# Altium schematic sheet STM32F407.SchDoc
size A3; Organization: ORGANIZATION; Address1: ADDRESS 1; Address2: ADDRESS 2; Address3: ADDRESS 3; Address4: ADDRESS 4; Revision: -; SheetNumber: 10; SheetTotal: 11; ENG_APP_DATE: --/--/--; DSN_APP_DATE: --/--/--; CHK_APP_DATE: --/--/--
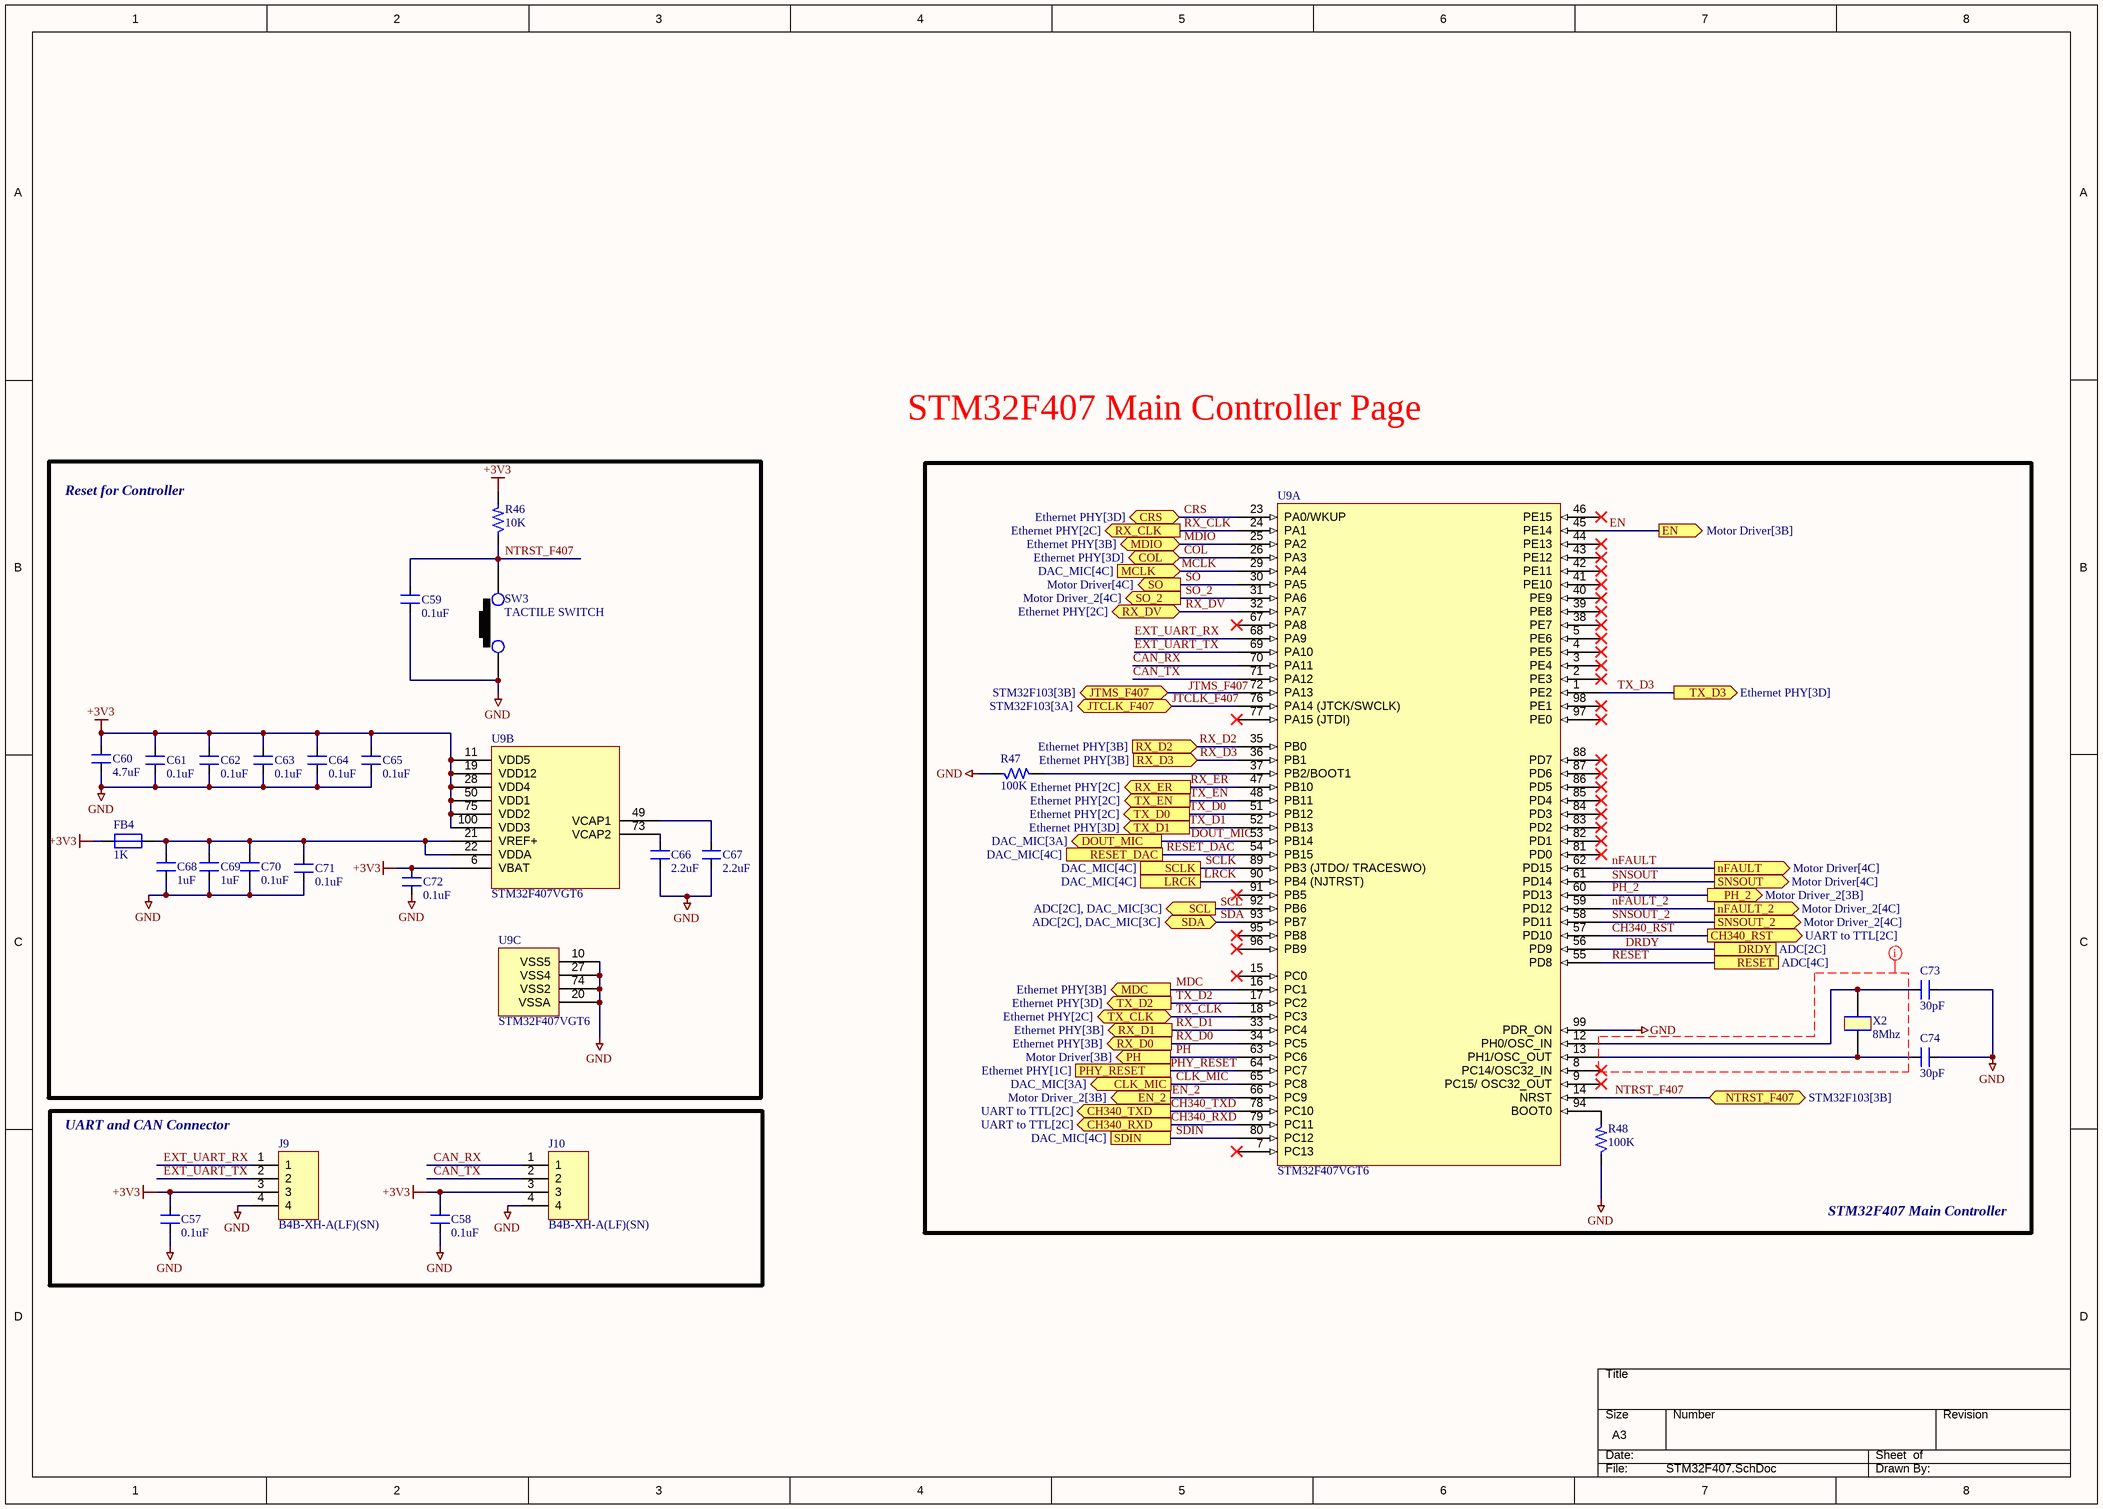
[diagram p0: STM32F407.SchDoc]

## Parts
C57  0.1uF  [CAP_0805]
C58  0.1uF  [CAP_0805]
C59  0.1uF  [CAP_0805]
C60  4.7uF  [CAP_0805]
C61  0.1uF  [CAP_0805]
C62  0.1uF  [CAP_0805]
C63  0.1uF  [CAP_0805]
C64  0.1uF  [CAP_0805]
C65  0.1uF  [CAP_0805]
C66  2.2uF  [CAP_0805]
C67  2.2uF  [CAP_0805]
C68  1uF  [CAP_0805]
C69  1uF  [CAP_0805]
C70  0.1uF  [CAP_0805]
C71  0.1uF  [CAP_0805]
C72  0.1uF  [CAP_0805]
C73  30pF  [CAP_0805]
C74  30pF  [CAP_0805]
FB4  1K  [IND_0805]
J9  B4B-XH-A(LF)(SN)  [CON4_100_B4B-XH-A_TH_ST]
J10  B4B-XH-A(LF)(SN)  [CON4_100_B4B-XH-A_TH_ST]
R46  10K  [RES_0603]
R47  100K  [RES_0603]
R48  100K  [RES_0603]
SW3  TACTILE SWITCH  [SW_342_SMD]
U9  STM32F407VGT6  [QFN100_19.6_669_58X10_SMD]  (parts A,B,C of 3)
X2  8Mhz  [XTAL_314_240X47_SMD]

## Blocks framed on the sheet
Reset for Controller: C59-C72 FB4 R46 SW3 U9
STM32F407 Main Controller: C73 C74 R47 R48 U9 X2
UART and CAN Connector: C57 C58 J9 J10

## Ports
CH340_RST (out, see UART to TTL[2C]), CH340_RXD (out, see UART to TTL[2C]), CH340_TXD (out, see UART to TTL[2C]), CLK_MIC (out, see DAC_MIC[3A]), COL (bidir, see Ethernet PHY[3D]), CRS (bidir, see Ethernet PHY[3D]), DOUT_MIC (out, see DAC_MIC[3A]), DRDY (see ADC[2C]), EN (out, see Motor Driver[3B]), EN_2 (out, see Motor Driver_2[3B]), JTCLK_F407 (bidir, see STM32F103[3A]), JTMS_F407 (bidir, see STM32F103[3B]), LRCK (see DAC_MIC[4C]), MCLK (in, see DAC_MIC[4C]), MDC (out, see Ethernet PHY[3B]), MDIO (bidir, see Ethernet PHY[3B]), nFAULT (out, see Motor Driver[4C]), nFAULT_2 (out, see Motor Driver_2[4C]), NTRST_F407 (bidir, see STM32F103[3B]), PH (out, see Motor Driver[3B]), PH_2 (out, see Motor Driver_2[3B]), PHY_RESET (see Ethernet PHY[1C]), RESET (see ADC[4C]), RESET_DAC (see DAC_MIC[4C]), RX_CLK (out, see Ethernet PHY[2C]), RX_D0 (out, see Ethernet PHY[3B]), RX_D1 (out, see Ethernet PHY[3B]), RX_D2 (in, see Ethernet PHY[3B]), RX_D3 (in, see Ethernet PHY[3B]), RX_DV (bidir, see Ethernet PHY[2C]), RX_ER (out, see Ethernet PHY[2C]), SCL (out, see ADC[2C], DAC_MIC[3C]), SCLK (see DAC_MIC[4C]), SDA (bidir, see ADC[2C], DAC_MIC[3C]), SDIN (see DAC_MIC[4C]), SNSOUT (out, see Motor Driver[4C]), SNSOUT_2 (out, see Motor Driver_2[4C]), SO (out, see Motor Driver[4C]), SO_2 (out, see Motor Driver_2[4C]), TX_CLK (bidir, see Ethernet PHY[2C]), TX_D0 (out, see Ethernet PHY[2C]), TX_D1 (out, see Ethernet PHY[3D]), TX_D2 (out, see Ethernet PHY[3D]), TX_D3 (out, see Ethernet PHY[3D]), TX_EN (out, see Ethernet PHY[2C])

## Nets
+3V3: C57.2 C58.2 C60.2 C61.2 C62.2 C63.2 C64.2 C65.2 C72.2 FB4.1 J9.3 J10.3 R46.2 U9.6(VBAT) U9.11(VDD5) U9.19(VDD12) U9.28(VDD4) U9.50(VDD1) U9.75(VDD2) U9.100(VDD3)
GND: C57.1 C58.1 C59.1 C60.1 C61.1 C62.1 C63.1 C64.1 C65.1 C66.1 C67.1 C68.1 C69.1 C70.1 C71.1 C72.1 C73.2 C74.2 J9.4 J10.4 R47.1 R48.1 SW3.1 U9.10(VSS5) U9.20(VSSA) U9.27(VSS4) U9.74(VSS2) U9.99(PDR_ON)
CAN_RX: J10.1 U9.70(PA11)
CAN_TX: J10.2 U9.71(PA12)
CH340_RST: U9.57(PD10) ; port CH340_RST
CH340_RXD: U9.79(PC11) ; port CH340_RXD
CH340_TXD: U9.78(PC10) ; port CH340_TXD
CLK_MIC: U9.65(PC8) ; port CLK_MIC
COL: U9.26(PA3) ; port COL
CRS: U9.23(PA0/WKUP) ; port CRS
DOUT_MIC: U9.53(PB14) ; port DOUT_MIC
DRDY: U9.56(PD9) ; port DRDY
EN: U9.45(PE14) ; port EN
EN_2: U9.66(PC9) ; port EN_2
EXT_UART_RX: J9.1 U9.68(PA9)
EXT_UART_TX: J9.2 U9.69(PA10)
JTCLK_F407: U9.76(PA14_(JTCK/SWCLK)) ; port JTCLK_F407
JTMS_F407: U9.72(PA13) ; port JTMS_F407
LRCK: U9.90(PB4_(NJTRST)) ; port LRCK
MCLK: U9.29(PA4) ; port MCLK
MDC: U9.16(PC1) ; port MDC
MDIO: U9.25(PA2) ; port MDIO
nFAULT: U9.62(PD15) ; port nFAULT
nFAULT_2: U9.59(PD12) ; port nFAULT_2
NTRST_F407: C59.2 R46.1 SW3.2 U9.14(NRST) ; port NTRST_F407
PH: U9.63(PC6) ; port PH
PH_2: U9.60(PD13) ; port PH_2
PHY_RESET: U9.64(PC7) ; port PHY_RESET
RESET: U9.55(PD8) ; port RESET
RESET_DAC: U9.54(PB15) ; port RESET_DAC
RX_CLK: U9.24(PA1) ; port RX_CLK
RX_D0: U9.34(PC5) ; port RX_D0
RX_D1: U9.33(PC4) ; port RX_D1
RX_D2: U9.35(PB0) ; port RX_D2
RX_D3: U9.36(PB1) ; port RX_D3
RX_DV: U9.32(PA7) ; port RX_DV
RX_ER: U9.47(PB10) ; port RX_ER
SCL: U9.92(PB6) ; port SCL
SCLK: U9.89(PB3_(JTDO/_TRACESWO)) ; port SCLK
SDA: U9.93(PB7) ; port SDA
SDIN: U9.80(PC12) ; port SDIN
SNSOUT: U9.61(PD14) ; port SNSOUT
SNSOUT_2: U9.58(PD11) ; port SNSOUT_2
SO: U9.30(PA5) ; port SO
SO_2: U9.31(PA6) ; port SO_2
TX_CLK: U9.18(PC3) ; port TX_CLK
TX_D0: U9.51(PB12) ; port TX_D0
TX_D1: U9.52(PB13) ; port TX_D1
TX_D2: U9.17(PC2) ; port TX_D2
TX_D3: U9.1(PE2) ; port TX_D3
TX_EN: U9.48(PB11) ; port TX_EN
NetC66_2: C66.2 U9.73(VCAP2)
NetC67_2: C67.2 U9.49(VCAP1)
NetC68_2: C68.2 C69.2 C70.2 C71.2 FB4.2 U9.21(VREF+) U9.22(VDDA)
NetC73_1: C73.1 U9.12(PH0/OSC_IN) X2.2
NetC74_1: C74.1 U9.13(PH1/OSC_OUT) X2.1
NetR47_2: R47.2 U9.37(PB2/BOOT1)
NetR48_2: R48.2 U9.94(BOOT0)

Not connected (* = marked no-connect by the designer): U9 2(PE3)* 3(PE4)* 4(PE5)* 5(PE6)* 7(PC13)* 8(PC14/OSC32_IN)* 9(PC15/_OSC32_OUT)* 15(PC0)* 38(PE7)* 39(PE8)* 40(PE9)* 41(PE10)* 42(PE11)* 43(PE12)* 44(PE13)* 46(PE15)* 67(PA8)* 77(PA15_(JTDI))* 81(PD0)* 82(PD1)* 83(PD2)* 84(PD3)* 85(PD4)* 86(PD5)* 87(PD6)* 88(PD7)* 91(PB5)* 95(PB8)* 96(PB9)* 97(PE0)* 98(PE1)*

## Layout directives
net class OSC_Nets: GND

## Notes on the sheet
- STM32F407 Main Controller Page
- Labels drawn without touching a wire or pin: DRDY, JTMS_F407, SCL, SNSOUT
- DWG. NO.
- REV.
- SHT.
- THIS DOCUMENT AND THE DATA DISCLOSED HEREIN OR HEREWITH IS THE PROPERTY OF ALTIUM LIMITED AND MAY BE FREELY DISTRIBUTED IN WHOLE. NO RIGHTS ARE RESERVED OR EXPRESS OR IMPLIED WARANTEE GIVEN.
- REVISION
- DESCRIPTION
- DATE
- APPROVED
- ENG:
- APPROVALS
- PROJECT
- DSN:
- CHK:
- REFERENCE DOCUMENTS
- PROJECT REVISION:
- TITLE
- DOCUMENT REVISION:
- DESIGN ITEM:
- BOM:
- FAB DWG:
- PCB DWG:
- ASSY DWG:
- SCALE:
- SIZE
- B
- CAGE CODE
- FILE NAME
- DWG NO.
- SHEET
- OF
- REV

## Library data of the parts
C57 C58 = CAP_0.1uF-50V-10%-0805: 0.1µF ±10% 50V Ceramic Capacitor X7R 0805 (2012 Metric); Manufacturer: Samsung; Manufacturer Part Number: CL21B104KBCNNNC; Alternate Part Number-1: NA; Case/Package: 0805; Supplier-1: SIRICOM; Supplier Part Number-1: 0805B104K500CT
C59 C61-C65 C70-C72 = CAP_0.1uF-50V-20%-0805: 0.1µF ±20% 50V Ceramic Capacitor X7R 0805 (2012 Metric); Manufacturer: Samsung Electro-Mechanics; Manufacturer Part Number: CL21B104MBCNNNC; Alternate Part Number-1: NA; Case/Package: 0805; Supplier-1: SIRICOM; Supplier Part Number-1: 0805B104K500CT
C60 = CAP_4.7uF-50V-10%-0805: 4.7µF ±10% 50V Ceramic Capacitor X5R 0805 (2012 Metric); Manufacturer: Yageo; Manufacturer Part Number: GRM21BR61H475KE51L; Alternate Part Number-1: NA; Case/Package: 0805; Supplier-1: SIRICOM; Supplier Part Number-1: CL21A475KBQNNNE
C66 C67 = CAP_2.2uF-25V-10%-0805: 2.2µF ±10% 25V Ceramic Capacitor X7R 0805 (2012 Metric); Manufacturer: KEMET; Manufacturer Part Number: CL21B225KAFNFNE; Alternate Part Number-1: NA; Case/Package: 0805; Supplier-1: SIRICOM; Supplier Part Number-1: CL21A225KAFNNNE
C68 C69 = CAP_1uF-50V-5%-0805: 1µF ±5% 50V Ceramic Capacitor X7R 0805 (2012 Metric); Manufacturer: Samsung; Manufacturer Part Number: CC0805JKX7R9BB105; Alternate Part Number-1: 0805F105M500NT; Case/Package: 0805; Supplier-1: SIRICOM; Supplier Part Number-1: CL21B105KBFNNNE
C73 C74 = CAP_30pF-50V-10%-0805: ±10% 50V Ceramic Capacitor C0G, NP0 0805 (2012 Metric); Manufacturer Part Number: C0805C300K5GAC7800; Manufacturer: KEMET; Alternate Part Number: NA; Case/Package: 0805; Supplier-1: Digikey; Supplier Part Number-1: 399-17443-1-ND - Cut Tape (CT)
FB4 = FB_1K-100MHZ-1.6A-0805: 1 kOhms @ 100MHz 1 Power Line Ferrite Bead 0805 (2012 Metric) 1.6A; Manufacturer: Laird; Manufacturer Part Number: BLM21SP102SH1D; Alternate Part Number-1: NA; Case/Package: 0805; Supplier-1: SIRICOM; Supplier Part Number-1: ACMS201209A102
J9 J10 = CON-PLG_4X1-100-ST-TH: 4 Pins, 1 Row 2.54mm Pitch, straight Connector, male; Manufacturer: Wurth Electronics; Mating Part Number: XHP-4; Crimp Part Number: ASXHSXH22K51; Alternate Part Number-1: NA; Manufacturer Part Number: B4B-XH-A(LF)(SN); Case/Package: TH-CON; Supplier-1: LCSC; Supplier Part Number-1: B4B-XH-A(LF)(SN)
R46 = RES_10K-0.1W-1%-0603: 10 kOhms ±1% 0.1W, 1/10W Chip Resistor 0603 (1608 Metric) Automotive AEC-Q200 Thick Film; Manufacturer: Walsin; Manufacturer Part Number: WR06X1002FTL; Alternate Part Number-1: 0603WAJ0103T5E; Case/Package: 0603; Supplier-1: SIRICOM; Supplier Part Number-1: WR06X1002FTL
R47 R48 = RES_100K-0.1W-1%-0603: 100 kOhms ±1% 0.1W, 1/10W Chip Resistor 0603 (1608 Metric) Automotive AEC-Q200 Thick Film; Manufacturer: Stackpole Electronics; Manufacturer Part Number: RMCF0603FT100K; Alternate Part Number-1: NA; Case/Package: 0603; Supplier-1: Arrow; Supplier Part Number-1: RMCF0603FT100K
SW3 = SW1_RS-282G05A3-SMRT-SMD: Tactile Switch SPST-NO Top Actuated Surface Mount; Manufacturer: ITT C&K; Alternate Part Number-1: NA; Manufacturer Part Number: RS-282G05A3-SMRT; Case/Package: SMD; Supplier-1: SP ROAD; Supplier Part Number-1: RS-282G05A3-SMRT
U9 = IC_STM32F407VGT6: ARM® Cortex®-M4 STM32F4 Microcontroller IC 32-Bit 168MHz 1MB (1M x 8) FLASH 100-LQFP (14x14); Manufacturer: STMicroelectronics; Alternate Part Number-1: STM32F407VET6; Manufacturer Part Number: STM32F407VGT6; Case/Package: LQFP100; Supplier-1: ARROW; Supplier Part Number-1: STM32F407VGT6
X2 = XTAL_8MHZ-ECS-80-32-5PX-SMD: 8MHz ±30ppm Crystal 32pF 60 Ohms HC-49/US; Manufacturer: Fox Electronics; Manufacturer Part Number: ECS-80-32-5PX-TR; Alternate Part Number-1: NA; Case/Package: SMD/SMT; Supplier-1: SP ROAD; Supplier Part Number-1: ECS-80-32-5PX-TR